# Altium schematic sheet KNOB.SchDoc
size A4; SheetNumber: 4; SheetTotal: 5
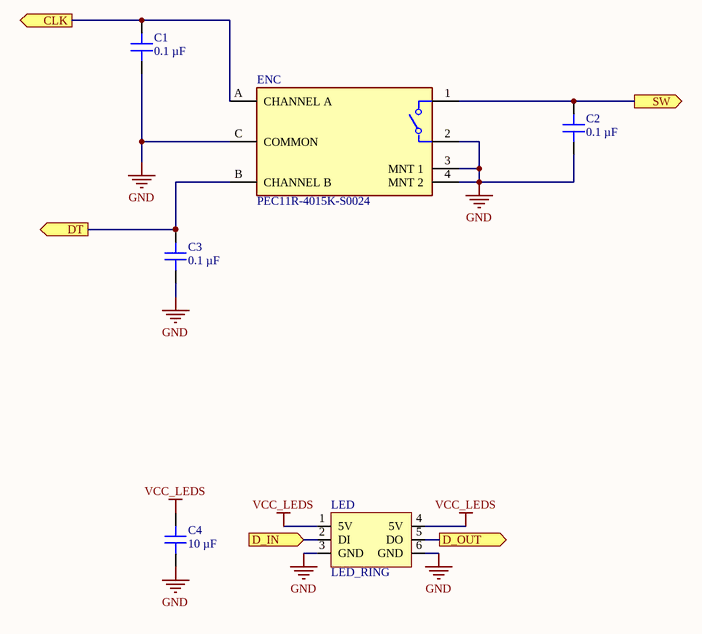
[diagram p0: KNOB.SchDoc]

## Parts
C1  0.1 µF  [CAP 0603_1608]
C2  0.1 µF  [CAP 0603_1608]
C3  0.1 µF  [CAP 0603_1608]
C4  10 µF  [MURATA GRM188 0603_1608]
ENC  PEC11R-4015K-S0024  [FP-PEC11R-4015K-S0024-MFG]
LED  LED_RING  [LED_RING]

## Ports
CLK (out), D_IN (in), D_OUT (out), DT (out), SW (out)

## Nets
GND: C1.1 C2.1 C3.1 C4.1 ENC.2 ENC.3(MNT_1) ENC.4(MNT_2) ENC.C(COMMON) LED.3(GND) LED.6(GND)
VCC_LEDS: C4.2 LED.1(5V) LED.4(5V)
CLK: C1.2 ENC.A(CHANNEL_A) ; port CLK
D_IN: LED.2(DI) ; port D_IN
D_OUT: LED.5(DO) ; port D_OUT
DT: C3.2 ENC.B(CHANNEL_B) ; port DT
SW: C2.2 ENC.1 ; port SW

## Library data of the parts
C1-C3 = CC0603KPX7R7BB104: CAP CER 0.1UF 16V X7R 0603; manufacturer: Yageo; Tolerance: ±10%; Part Number: CC0603KPX7R7BB104; Value: 0.1 µF; Applications: General Purpose; Capacitance: 0.1 µF; componentlink1description: Datasheet; componentlink1url: https://www.yageo.com/upload/media/product/productsearch/datasheet/mlcc/UPY-GPHC_X7R_6.3V-to-50V_18.pdf; componentlink2description: DigiKey Link; componentlink2url: https://www.digikey.com/en/products/detail/yageo/CC0603KPX7R7BB104/2103073; Device Package: 0603 (1608 Metric); lastupdated: 2/9/2024 8:10:09 PM; Lifecycle Status: Active; Minimum Order: 1; Mounting Type: Surface Mount, MLCC; Operating Temperature: -55°C ~ 125°C; Package / Case: 0603 (1608 Metric); packaging: TapeAndReel; partid: 16718; Part Status: Active; price: 0.01; series: CC; Size / Dimension: 0.063" L x 0.031" W (1.60mm x 0.80mm); Supplier 1: DigiKey; Supplier Part Number 1: 311-1335-1-ND; Temperature Coefficient: X7R; Thickness (Max): 0.035" (0.90mm); Voltage - Rated: 16V
C4 = GRM188Z71A106KA73D: CAP CER 10UF 10V X7R 0603; manufacturer: Murata Electronics; Tolerance: ±10%; Part Number: GRM188Z71A106KA73D; Value: 10 µF; Applications: General Purpose; Capacitance: 10 µF; componentlink1description: Datasheet; componentlink1url: https://search.murata.co.jp/Ceramy/image/img/A01X/G101/ENG/GRM188Z71A106KA73-01A.pdf; componentlink2description: DigiKey Link; componentlink2url: https://www.digikey.com/en/products/detail/murata-electronics/GRM188Z71A106KA73D/13401725; Device Package: 0603 (1608 Metric); lastupdated: 7/20/2024 12:23:19 AM; Lifecycle Status: Active; Minimum Order: 1; Mounting Type: Surface Mount, MLCC; Operating Temperature: -55°C ~ 125°C; Package / Case: 0603 (1608 Metric); packaging: TapeAndReel; partid: 44714; Part Status: Active; price: 0.06; series: GRM; Size / Dimension: 0.063" L x 0.031" W (1.60mm x 0.80mm); Supplier 1: DigiKey; Supplier Part Number 1: 490-GRM188Z71A106KA73DCT-ND; Temperature Coefficient: X7R; Thickness (Max): 0.039" (1.00mm); Voltage - Rated: 10V
ENC = CMP-07421-000013-1: ROTARY ENCODER MECHANICAL 24PPR; Output Type: Quadrature; Number of Channels: 2; Detent: No; Built in Switch: Yes; Pulses per Revolution: 24; Height: 13.4mm; Series: PEC11R; Package Quantity: 75; Encoder Type: Mechanical; Max Operating Temperature: 70°C; Packaging: Bulk; Mount: Through Hole; RoHS Compliant: Yes; Width: 12.5mm; Length: 21.5mm; Orientation: Vertical; Termination: PC Pin; Min Operating Temperature: -30°C